# EAGLE design Potong6 (EAGLE 5.11)
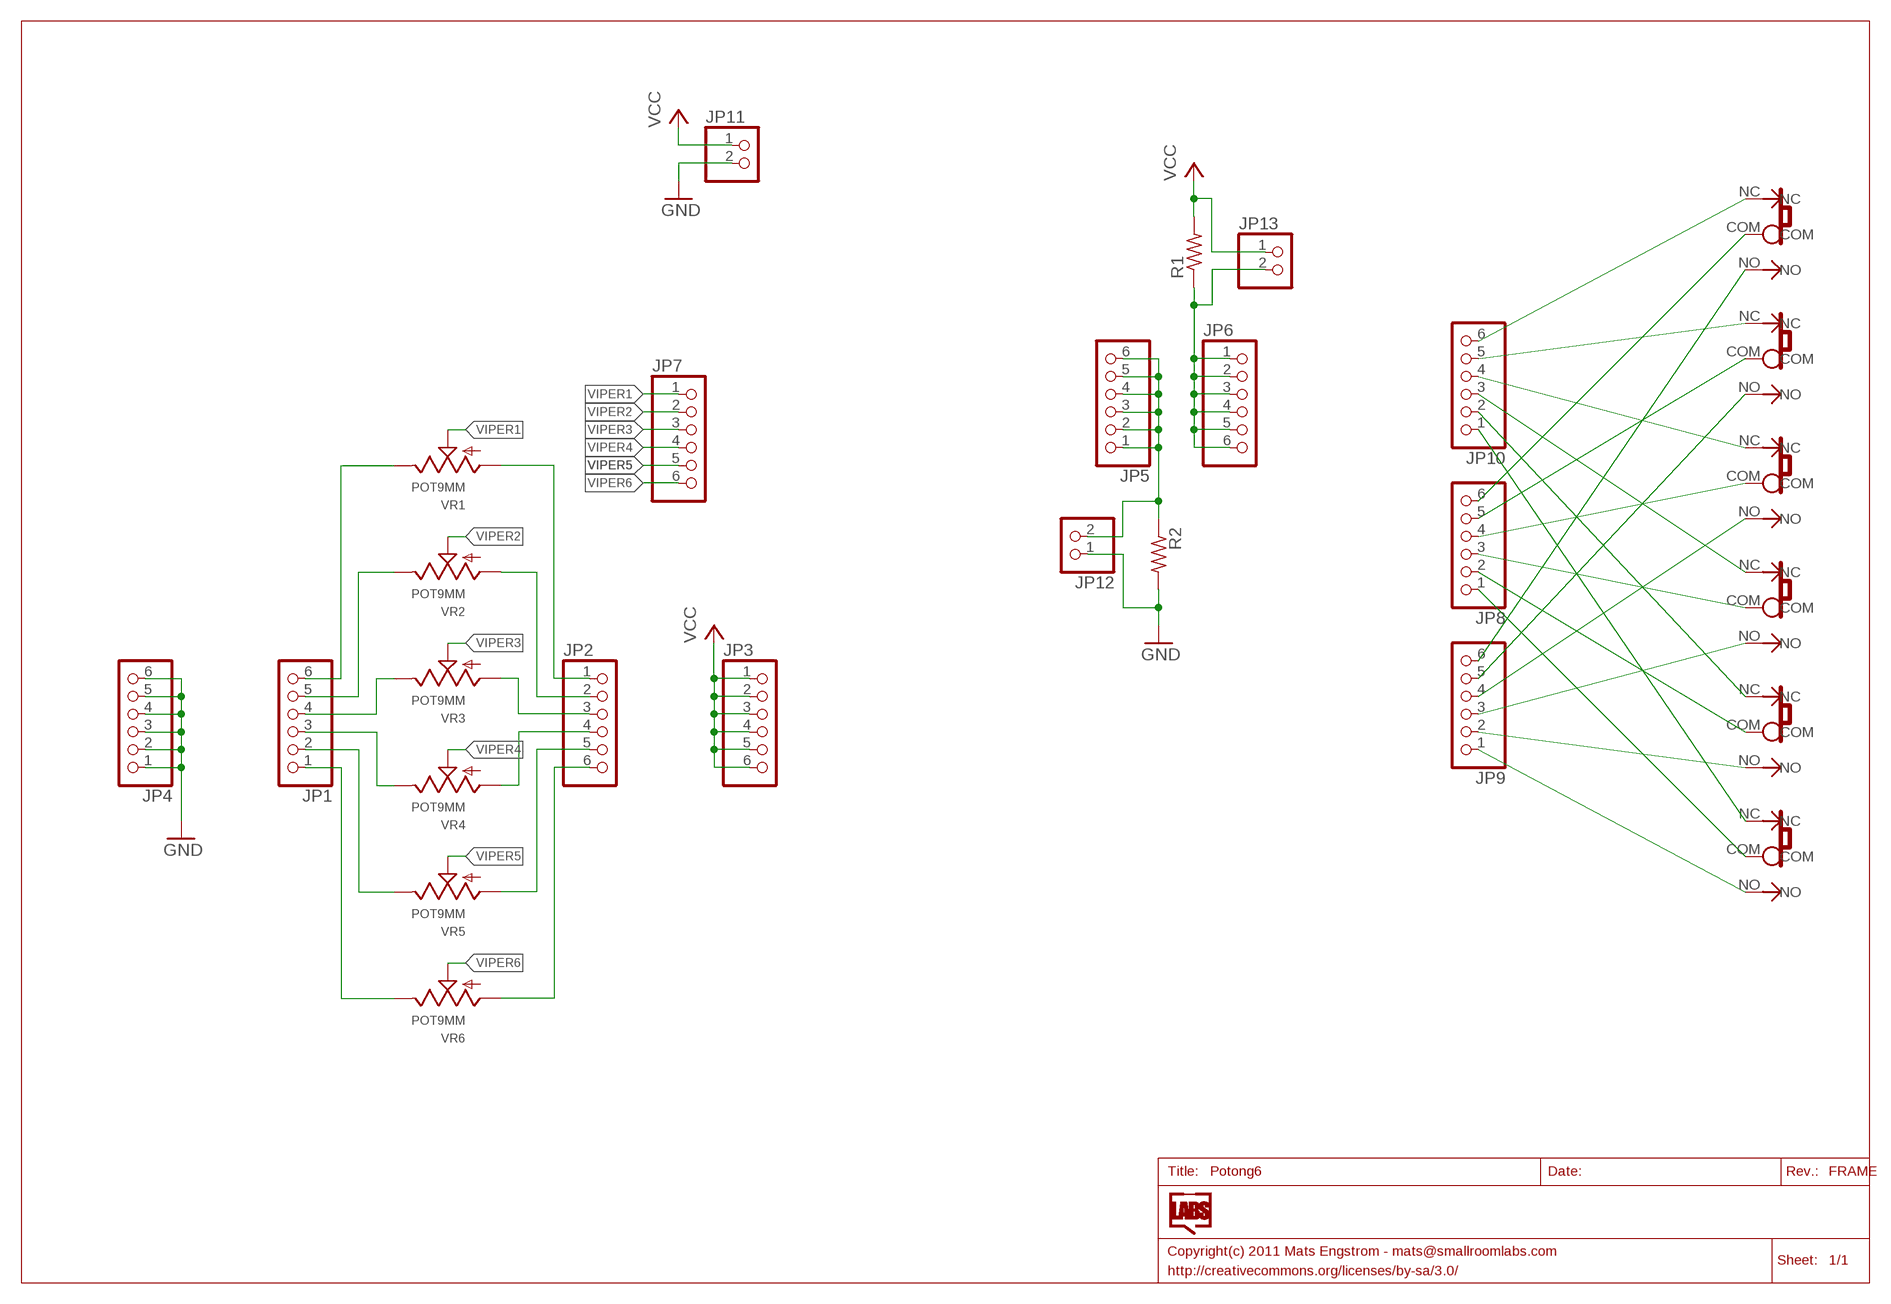
[diagram p0: schematic, sheet 1]

## Parts
JP1  PINHD-1X6CB  [1X06-CLEANBIG]
JP2  PINHD-1X6CB  [1X06-CLEANBIG]
JP3  PINHD-1X6CB  [1X06-CLEANBIG]
JP4  PINHD-1X6CB  [1X06-CLEANBIG]
JP5  PINHD-1X6CB  [1X06-CLEANBIG]
JP6  PINHD-1X6CB  [1X06-CLEANBIG]
JP7  PINHD-1X6CB  [1X06-CLEANBIG]
JP8  PINHD-1X6CB  [1X06-CLEANBIG]
JP9  PINHD-1X6CB  [1X06-CLEANBIG]
JP10  PINHD-1X6CB  [1X06-CLEANBIG]
JP11  PINHD-1X2  [1X02]
JP12  PINHD-1X2  [1X02]
JP13  PINHD-1X2  [1X02]
R1  R-US_0207/10  [0207/10]
R2  R-US_0207/10  [0207/10]
SW1  SLIDESWITCH-4MM  [SS12D07VG4]
SW2  SLIDESWITCH-4MM  [SS12D07VG4]
SW3  SLIDESWITCH-4MM  [SS12D07VG4]
SW4  SLIDESWITCH-4MM  [SS12D07VG4]
SW5  SLIDESWITCH-4MM  [SS12D07VG4]
SW6  SLIDESWITCH-4MM  [SS12D07VG4]
VR1  POT9MM  [POT9MM]
VR2  POT9MM  [POT9MM]
VR3  POT9MM  [POT9MM]
VR4  POT9MM  [POT9MM]
VR5  POT9MM  [POT9MM]
VR6  POT9MM  [POT9MM]

## Nets
GND: JP4.1 JP4.2 JP4.3 JP4.4 JP4.5 JP4.6 JP11.2 JP12.1 R2.2
N$1: JP1.1 VR6.CW(E)
N$2: JP1.2 VR5.CW(E)
N$3: JP1.3 VR4.CW(E)
N$4: JP1.4 VR3.CW(E)
N$5: JP1.5 VR2.CW(E)
N$6: JP1.6 VR1.CW(E)
N$7: JP2.1 VR1.CCW(A)
N$8: JP2.2 VR2.CCW(A)
N$9: JP2.3 VR3.CCW(A)
N$10: JP2.4 VR4.CCW(A)
N$11: JP2.5 VR5.CCW(A)
N$12: JP2.6 VR6.CCW(A)
N$13: JP8.6 SW1.COM
N$14: JP8.5 SW2.COM
N$15: JP8.4 SW3.COM
N$16: JP8.3 SW4.COM
N$17: JP8.2 SW5.COM
N$18: JP8.1 SW6.COM
N$19: JP10.6 SW1.NC
N$20: JP10.5 SW2.NC
N$21: JP10.4 SW3.NC
N$22: JP10.3 SW4.NC
N$23: JP10.2 SW5.NC
N$24: JP10.1 SW6.NC
N$25: JP9.1 SW6.NO
N$26: JP9.2 SW5.NO
N$27: JP9.3 SW4.NO
N$28: JP9.4 SW3.NO
N$29: JP9.5 SW2.NO
N$30: JP9.6 SW1.NO
N$32: JP5.1 JP5.2 JP5.3 JP5.4 JP5.5 JP5.6 JP12.2 R2.1
N$33: JP6.1 JP6.2 JP6.3 JP6.4 JP6.5 JP6.6 JP13.2 R1.1
VCC: JP3.1 JP3.2 JP3.3 JP3.4 JP3.5 JP3.6 JP11.1 JP13.1 R1.2
VIPER1: JP7.1 VR1.W(S)
VIPER2: JP7.2 VR2.W(S)
VIPER3: JP7.3 VR3.W(S)
VIPER4: JP7.4 VR4.W(S)
VIPER5: JP7.5 VR5.W(S)
VIPER6: JP7.6 VR6.W(S)

## Library data of the parts
JP1-JP10 = adafruit:PINHD-1X6: PIN HEADER
JP11-JP13 = pinhead:PINHD-1X2: PIN HEADER
R1 R2 = resistor:R-US_: RESISTOR, American symbol
SW1-SW6 = SmallRoomLabs:SLIDESWITCH
VR1-VR6 = SmallRoomLabs:POT

## Net classes
0 default: width 0.229 mm, drill 0.4 mm, clearance 0.229 mm

## Board
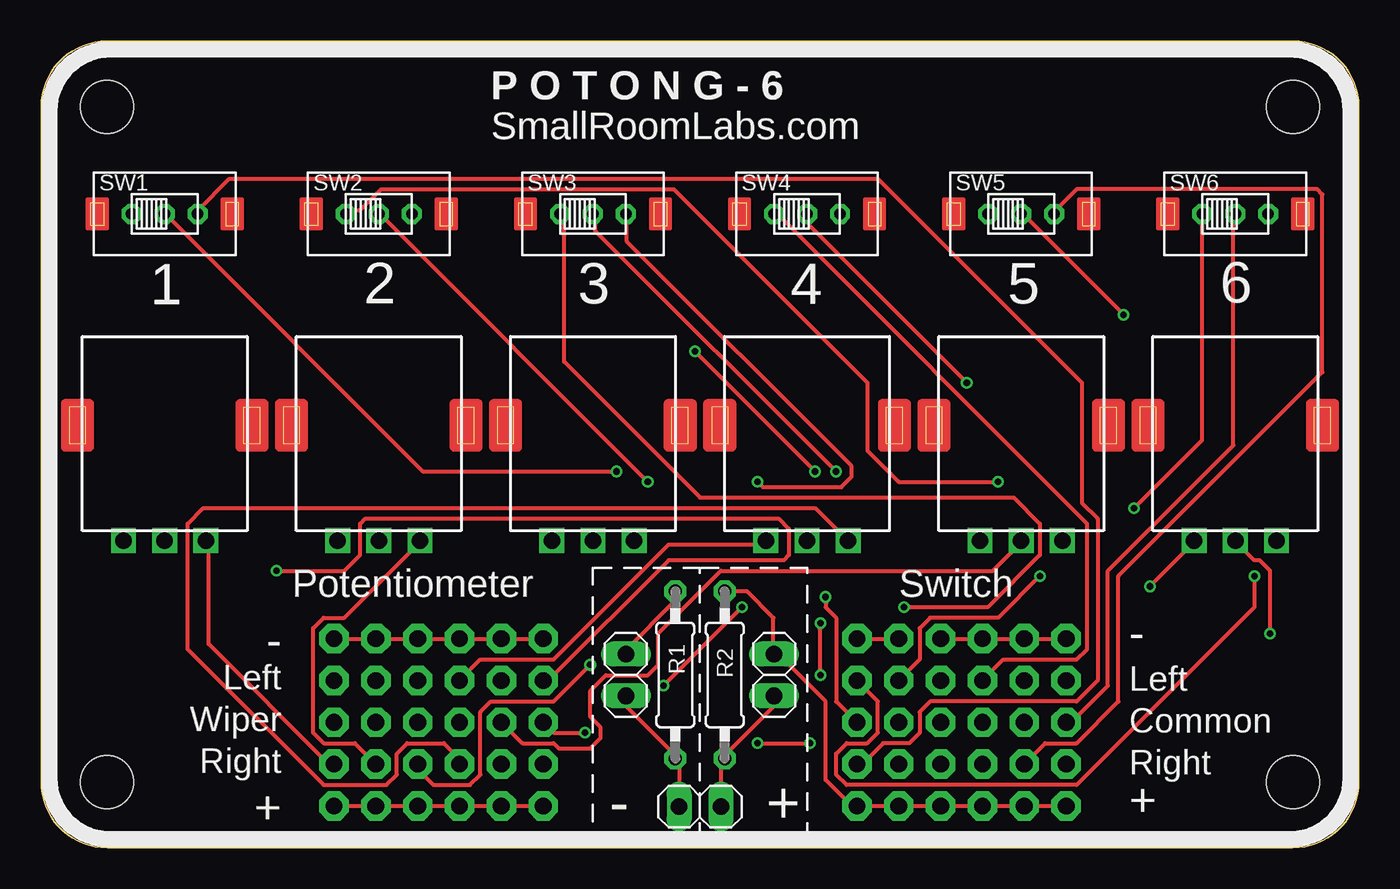
[diagram p1: board, top side]
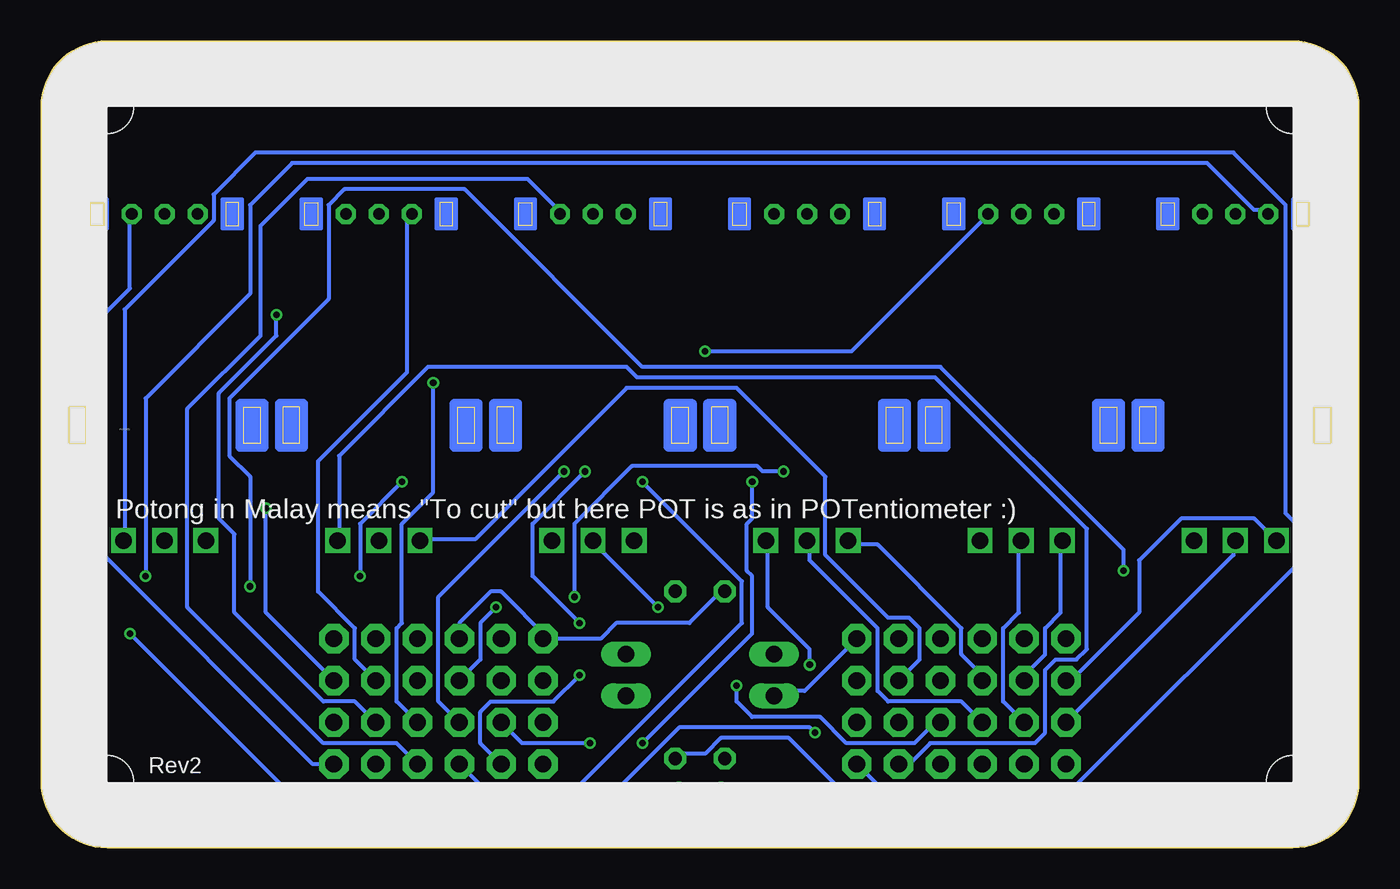
[diagram p2: board, bottom side, seen from below]

Size 80 x 49 mm. Coordinates in mm from the lower left corner, seen from the top.
Outline: 0,45 arc-90 4,49 76,49 arc-90 80,45 80,4 arc-90 76,0 4,0 arc-90 0,4 0,45
Copper layers (1*16): Top 0.035mm / dielectric 1.5mm / Bottom 0.035mm
Design rules "SmartPrototyping": minimum track width 7mil, minimum drill 12mil, track to track 7mil, track to pad 7mil, pad to pad 7mil, via to via 7mil, smd to smd 0mil, copper to edge 20mil, drill to drill 10mil, minimum pad ring 10mil, minimum via ring 6mil, stop-mask expansion 2mil, vias tented up to drill 25mil, thermal gap 10mil
Holes 3.2 mm at 4,4 76,4 76,45 4,45
vRestrict: area 65.4,0.6 to 72.4,12.7; area 6.3,1.3 to 14.6,13.3; area 2,37 to 77.5,40; area 3.2,17.2 to 76,20; area 0.8,23.5 to 79.2,27.8; area 16.5,1 to 32,14; area 48,1 to 63.5,14; area 14.9,14.9 to 32.8,17.3; area 51.8,15 to 60.2,17.3

### Footprints (pad centres in the part's own frame; a part is rotated, then mirrored left to right if it is on the bottom)
1X06-CLEANBIG = drill 1.016 pad 1.778 octagon: 1 -6.35,0; 2 -3.81,0; 3 -1.27,0; 4 1.27,0; 5 3.81,0; 6 6.35,0
1X02 = drill 1.016 long: 1 -1.27,0; 2 1.27,0
0207/10 = drill 0.813 octagon: 1 -5.08,0; 2 5.08,0
SS12D07VG4 = drill 0.7 octagon: COM 0,0; NC 2,0; NO -2,0
POT9MM = drill 1 square: CCW -2.5,-7; CW 2.5,-7; W 0,-7

### Placement (x,y rotation side)
JP1  24.13,5.08 180 top
JP2  24.13,10.16 0 top
JP3  24.13,2.54 180 top
JP4  24.13,12.7 0 top
JP5  55.88,12.7 180 top
JP6  55.88,2.54 180 top
JP7  24.13,7.62 0 top
JP8  55.88,7.62 180 top
JP9  55.88,10.16 180 top
JP10  55.88,5.08 180 top
JP11  40,2.5 180 top
JP12  35.5,10.5 90 top
JP13  44.5,10.5 90 top
R1  41.5,10.5 270 top
R2  38.5,10.5 270 top
SW1  7.5,38.5 0 top
SW2  20.5,38.5 0 top
SW3  33.5,38.5 0 top
SW4  46.5,38.5 0 top
SW5  59.5,38.5 0 top
SW6  72.5,38.5 0 top
VR1  7.5,25.66 0 top
VR2  20.5,25.66 0 top
VR3  33.5,25.66 0 top
VR4  46.5,25.66 0 top
VR5  59.5,25.66 0 top
VR6  72.5,25.66 0 top

### Tracks (layer width: path | path; a pad name or v marks a point on that pad's centre or on a via)
GND
  Top 0.229: JP11.2 38.73,2.54 38.73,5.4 R2.2 38.42,5.71 35.56,8.57 35.56,9.21 JP12.1 | JP4.1 JP4.2 JP4.3 JP4.4 JP4.5 JP4.6
  Bottom 0.229: JP4.6 33.66,9.53 35.24,9.53 JP12.1
N$1
  Bottom 0.229: JP1.1 29.21,3.81 17.14,3.81 3.81,17.14 3.81,19.68 4.45,20.32 4.45,39.05 7.62,42.23 66.99,42.23 69.53,39.69 69.53,38.1 74.93,32.7 74.93,18.73 VR6.CW
N$2
  Bottom 0.229: JP1.2 27.3,5.08 26.04,6.35 19.68,6.35 19.05,6.99 19.05,10.79 18.41,11.43 17.14,11.43 16.51,12.06 16.51,19.37 25.72,28.57 43.81,28.57 44.45,29.21 56.52,29.21 61.91,23.81 61.91,18.73 VR5.CW
N$3
  Top 0.229: JP1.3 25.4,5.4 24.45,6.35 22.23,6.35 21.59,5.71 21.59,4.45 20.95,3.81 17.14,3.81 8.89,12.06 8.89,19.68 9.84,20.64 46.99,20.64 48.9,18.73 VR4.CW
N$4  (via drill 0.4)
  Top 0.229: v33.34,11.11 31.11,8.89 27.3,8.89 26.67,8.26 26.67,4.45 26.04,3.81 23.81,3.81 22.86,4.76 JP1.4
  Bottom 0.229: v33.34,11.11 33.34,12.06 35.88,14.61 35.88,18.41 VR3.CW
N$5
  Top 0.229: JP1.5 19.05,6.35 17.14,6.35 16.51,6.99 16.51,13.34 17.14,13.97 18.41,13.97 22.86,18.41 VR2.CW
N$6
  Top 0.229: JP1.6 17.46,5.08 10.16,12.38 10.16,18.41 VR1.CW
N$7
  Bottom 0.229: JP2.1 17.46,10.16 13.34,14.29 13.34,17.46 10.79,20 6.35,20 5.08,18.73 VR1.CCW
N$8
  Bottom 0.229: JP2.2 20.32,10.48 19.05,11.75 19.05,13.34 18.1,14.29 18.1,18.41 VR2.CCW
N$9
  Bottom 0.229: JP2.3 22.86,10.48 24.13,11.75 24.13,13.34 29.21,18.41 30.8,18.41 VR3.CCW
N$10
  Top 0.229: JP2.4 26.67,11.43 31.11,11.43 38.1,18.41 43.81,18.41 VR4.CCW
N$11
  Bottom 0.229: JP2.5 26.67,11.43 26.67,13.34 27.3,13.97 28.57,13.97 32.38,17.78 32.38,22.54 37.78,27.94 44.45,27.94 53.66,18.73 56.83,18.73 VR5.CCW
N$12  (via drill 0.4)
  Top 0.229: v67.31,15.88 69.85,18.41 VR6.CCW | v14.29,16.83 18.41,16.83 19.37,17.78 19.37,19.68 19.68,20 44.77,20 45.4,19.37 45.4,17.78 45.09,17.46 38.1,17.46 30.8,10.16 JP2.6
  Bottom 0.229: v67.31,15.88 67.31,22.54 68.58,23.81 68.58,27.3 62.55,33.34 62.55,39.05 61.59,40.01 54.29,40.01 43.5,29.21 25.4,29.21 14.29,18.1 v14.29,16.83
N$13  (via drill 0.4)
  Top 0.229: v34.92,22.86 23.18,22.86 7.62,38.42 SW1.COM | v47.62,15.24 47.62,14.61 48.26,13.97 48.26,8.89 JP8.6
  Bottom 0.229: v34.92,22.86 36.2,22.86 36.51,23.18 44.13,23.18 47.62,19.68 v47.62,15.24
N$14  (via drill 0.4)
  Top 0.229: v36.83,22.23 20.64,38.42 SW2.COM | v43.5,6.35 v46.67,6.35
  Bottom 0.229: v36.83,22.23 36.83,20 37.15,19.68 37.15,16.83 36.83,16.51 36.83,13.02 v43.5,6.35 | v46.67,6.35 50.8,6.35 JP8.5
N$15  (via drill 0.4)
  Top 0.229: v48.26,22.86 33.66,37.47 33.66,38.42 SW3.COM
  Bottom 0.229: v48.26,22.86 55.88,15.24 55.88,8.89 JP8.4
N$16  (via drill 0.4)
  Top 0.229: v56.2,28.26 46.67,37.78 46.67,38.42 SW4.COM
  Bottom 0.229: v56.2,28.26 56.2,21.59 58.1,19.68 58.1,13.65 58.42,13.34 58.42,8.89 JP8.3
N$17  (via drill 0.4)
  Top 0.229: v65.72,32.38 59.69,38.42 SW5.COM
  Bottom 0.229: v65.72,32.38 65.72,31.11 69.22,27.62 69.22,20 68.26,19.05 68.26,14.29 62.87,8.89 60.96,8.89 JP8.2
N$18
  Top 0.229: JP8.1 62.55,7.62 64.77,9.84 64.77,16.83 72.39,24.45 72.39,38.42 SW6.COM
N$19
  Top 0.229: JP10.6 49.85,5.08 51.12,6.35 52.7,6.35 53.34,6.99 53.34,8.26 53.98,8.89 62.87,8.89 64.14,10.16 64.14,20 63.18,20.95 63.18,28.26 50.8,40.64 11.43,40.64 9.53,38.73 SW1.NC
N$20  (via drill 0.4)
  Top 0.229: v46.99,22.86 v39.69,30.16 | v47.31,10.48 v47.31,13.65
  Bottom 0.229: v39.69,30.16 30.8,30.16 22.54,38.42 SW2.NC | v46.99,22.86 50.16,19.68 50.16,16.51 v47.31,13.65 | v47.31,10.48 48.9,8.89 52.7,8.89 53.34,8.26 53.34,6.35 JP10.5
N$21  (via drill 0.4)
  Top 0.229: v43.5,22.23 43.81,21.91 48.58,21.91 49.21,22.54 49.21,23.18 35.56,36.83 35.56,38.42 SW3.NC
  Bottom 0.229: v43.5,22.23 37.47,16.19 37.47,13.65 47.31,3.81 53.34,3.81 JP10.4
N$22
  Bottom 0.229: JP10.3 58.42,6.35 62.87,6.35 71.12,14.61 71.12,26.67 66.67,31.11 66.67,37.78 63.82,40.64 50.48,40.64 48.58,38.73 SW4.NC
N$23
  Top 0.229: JP10.2 60.96,6.35 62.87,6.35 65.41,8.89 65.41,16.51 77.79,28.89 77.79,39.69 77.47,40.01 62.87,40.01 61.59,38.73 SW5.NC
N$24
  Bottom 0.229: JP10.1 63.5,5.08 76.2,17.78 76.2,32.38 74.61,33.97 74.61,38.42 SW6.NC
N$25  (via drill 0.4)
  Top 0.229: v66.36,20.64 70.48,24.77 70.48,38.42 SW6.NO
  Bottom 0.229: v66.36,20.64 66.36,14.29 JP9.1
N$26
  Bottom 0.229: JP9.2 60.96,11.43 60.96,13.34 63.18,15.56 63.18,23.5 57.78,28.89 57.78,38.42 SW5.NO
N$27
  Top 0.229: JP9.3 58.42,11.43 62.87,11.43 63.5,12.06 63.5,19.68 44.77,38.42 SW4.NO
N$28  (via drill 0.4)
  Top 0.229: v52.39,14.61 57.47,14.61 60.64,17.78 60.64,19.68 59.05,21.27 40.01,21.27 31.75,29.53 31.75,38.42 SW3.NO
  Bottom 0.229: v52.39,14.61 53.34,13.65 53.34,11.43 JP9.4
N$29  (via drill 0.4)
  Top 0.229: v58.1,22.23 52.07,22.23 50.16,24.13 50.16,28.26 38.42,40.01 20.64,40.01 19.37,38.73 18.73,38.73 SW2.NO | v60.64,16.51 58.1,13.97 53.98,13.97 53.34,13.34 53.34,11.43 JP9.5
  Bottom 0.229: v58.1,22.23 60.64,19.68 v60.64,16.51
N$30  (via drill 0.4)
  Top 0.229: v73.66,16.51 73.66,14.61 62.87,3.81 48.9,3.81 48.26,4.45 48.26,5.71 48.9,6.35 50.16,6.35 50.8,6.99 50.8,8.89 JP9.6
  Bottom 0.229: v73.66,16.51 73.66,27.3 67.31,33.66 67.31,39.05 64.77,41.59 9.21,41.59 6.35,38.73 5.71,38.73 SW1.NO
N$32
  Top 0.229: JP5.4 JP5.3 JP5.2 JP5.1 | JP5.6 JP5.5 | R2.1 38.42,15.56 38.42,14.92 35.56,12.06 JP12.2
  Bottom 0.229: 49.21,12.7 46.04,12.7 45.09,13.65 40.64,13.65 38.73,15.56 R2.1 | JP5.4 54.61,13.65 52.7,15.56 52.07,15.56 49.21,12.7 | 49.21,12.7 JP5.6
N$33
  Top 0.229: R1.1 41.59,15.56 42.86,15.56 44.45,13.97 44.45,12.06 JP13.2 44.77,11.75 47.62,8.89 47.62,4.13 49.21,2.54 JP6.6 JP6.5 JP6.4 JP6.3 JP6.2 JP6.1
VCC
  Top 0.229: JP11.1 41.27,2.54 41.27,5.4 R1.2 41.59,5.71 44.45,8.57 44.45,9.21 JP13.1 | JP3.6 JP3.5 JP3.4 JP3.3 JP3.2 JP3.1
  Bottom 0.229: JP3.1 34.61,6.67 38.73,6.67 39.69,5.71 41.27,5.71 R1.2
VIPER1
  Bottom 0.229: JP7.1 7.62,17.78 7.62,18.41 VR1.W
VIPER2
  Bottom 0.229: JP7.2 21.59,8.89 21.59,13.34 20.64,14.29 20.64,18.41 VR2.W
VIPER3
  Bottom 0.229: JP7.3 24.13,8.89 28.57,8.89 29.21,9.53 29.21,13.34 33.34,17.46 33.34,18.41 VR3.W
VIPER4  (via drill 0.4)
  Top 0.229: v37.78,9.84 v42.55,14.61
  Bottom 0.229: v42.55,14.61 46.35,18.41 VR4.W | v37.78,9.84 37.78,8.89 36.83,7.94 32.7,7.94 31.11,6.35 26.99,6.35 25.72,7.62 JP7.4
VIPER5
  Top 0.229: JP7.5 29.21,6.35 31.11,6.35 31.43,6.03 33.34,6.03 33.97,6.67 33.97,7.3 33.34,7.94 33.34,9.53 34.29,10.48 36.83,10.48 37.47,11.11 37.47,13.02 41.27,16.83 57.78,16.83 59.37,18.41 VR5.W
VIPER6  (via drill 0.4)
  Top 0.229: v74.61,13.02 74.61,16.83 73.98,17.46 73.66,17.46 72.71,18.41 VR6.W | v33.02,6.99 31.11,6.99 JP7.6
  Bottom 0.229: v74.61,13.02 62.87,1.27 47.31,1.27 41.27,7.3 33.34,7.3 v33.02,6.99

### Text on the board
tPlace: P O T O N G - 6 | SmallRoomLabs.com | 1 | 2 | 3 | 4 | 5 | 6 | Potentiometer | Switch | - | - | Left | Left | Wiper | Common | Right | Right | + | - | + | +
bPlace: POTONG | Potong in Malay means "To cut" but here POT is as in POTentiometer :) | Rev2
tNames: R1 | R2